# EAGLE design disp (EAGLE 7.7.0)
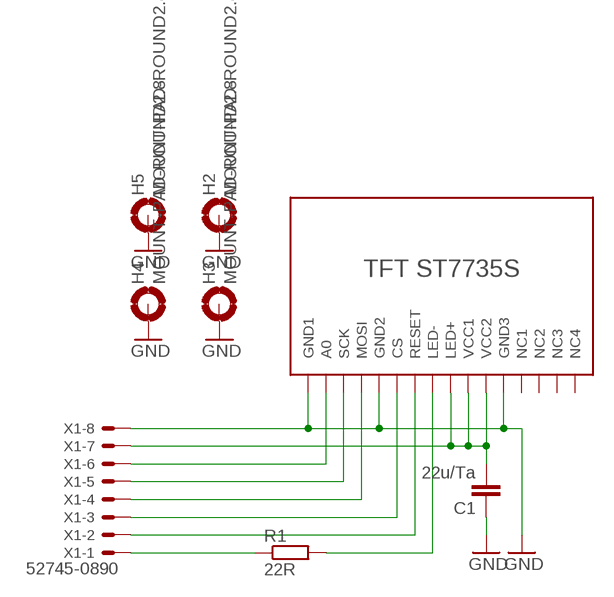
[diagram p0: schematic, sheet 1]

## Parts
C1  22u/Ta  C-EUC1206  [C1206]
H2  MOUNT-PAD-ROUND2.8  [2,8-PAD]
H3  MOUNT-PAD-ROUND2.8  [2,8-PAD]
H4  MOUNT-PAD-ROUND2.8  [2,8-PAD]
H5  MOUNT-PAD-ROUND2.8  [2,8-PAD]
R1  22R  R-EU_R0805  [R0805]
U$1  TFT_ST7735S  [TFT_ST7735S]
X1  52745-0890  [52745-0890]

## Nets
GND: C1.1 H2.B2,8(MOUNT) H3.B2,8(MOUNT) H4.B2,8(MOUNT) H5.B2,8(MOUNT) U$1.GND1 U$1.GND2 U$1.GND3 X1.8
N$2: C1.2 U$1.LED+ U$1.VCC1 U$1.VCC2 X1.7
N$4: U$1.A0 X1.6
N$5: U$1.SCK X1.5
N$6: U$1.MOSI X1.4
N$7: U$1.CS X1.3
N$8: U$1.RESET X1.2
N$9: R1.1 X1.1
N$10: R1.2 U$1.LED-
Unconnected: U$1.NC1 U$1.NC2 U$1.NC3 U$1.NC4

## Library data of the parts
C1 = rcl:C-EU: CAPACITOR, European symbol
H2-H5 = holes:MOUNT-PAD-ROUND: MOUNTING PAD, round
R1 = resistor:R-EU_: RESISTOR, European symbol
U$1 = ST7735S:TFT_ST7735S
X1 = con-molex:52745-0890: FFC/FPC-to-Board 0.50mm (.020") SMT Top Contact Right Angle, ZIF, Style Receptacle 52745 / 52435 Source: http://www.molex.com/product/ffc/52745.html; MPN: 52745-0890; OC_FARNELL: unknown; OC_NEWARK: 92M6377

## Board
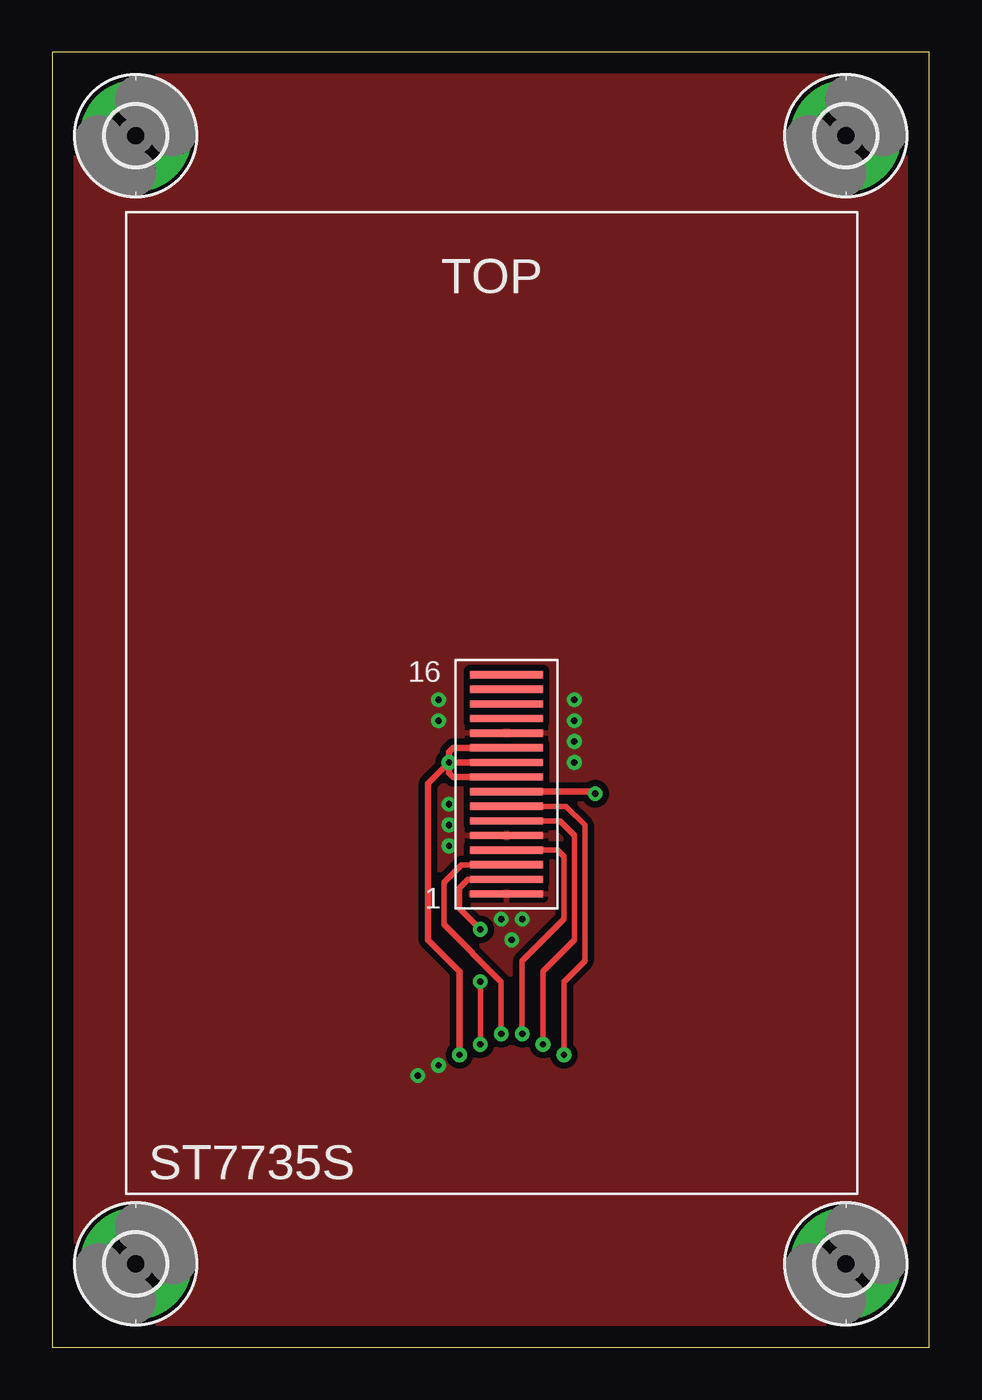
[diagram p1: board, top side]
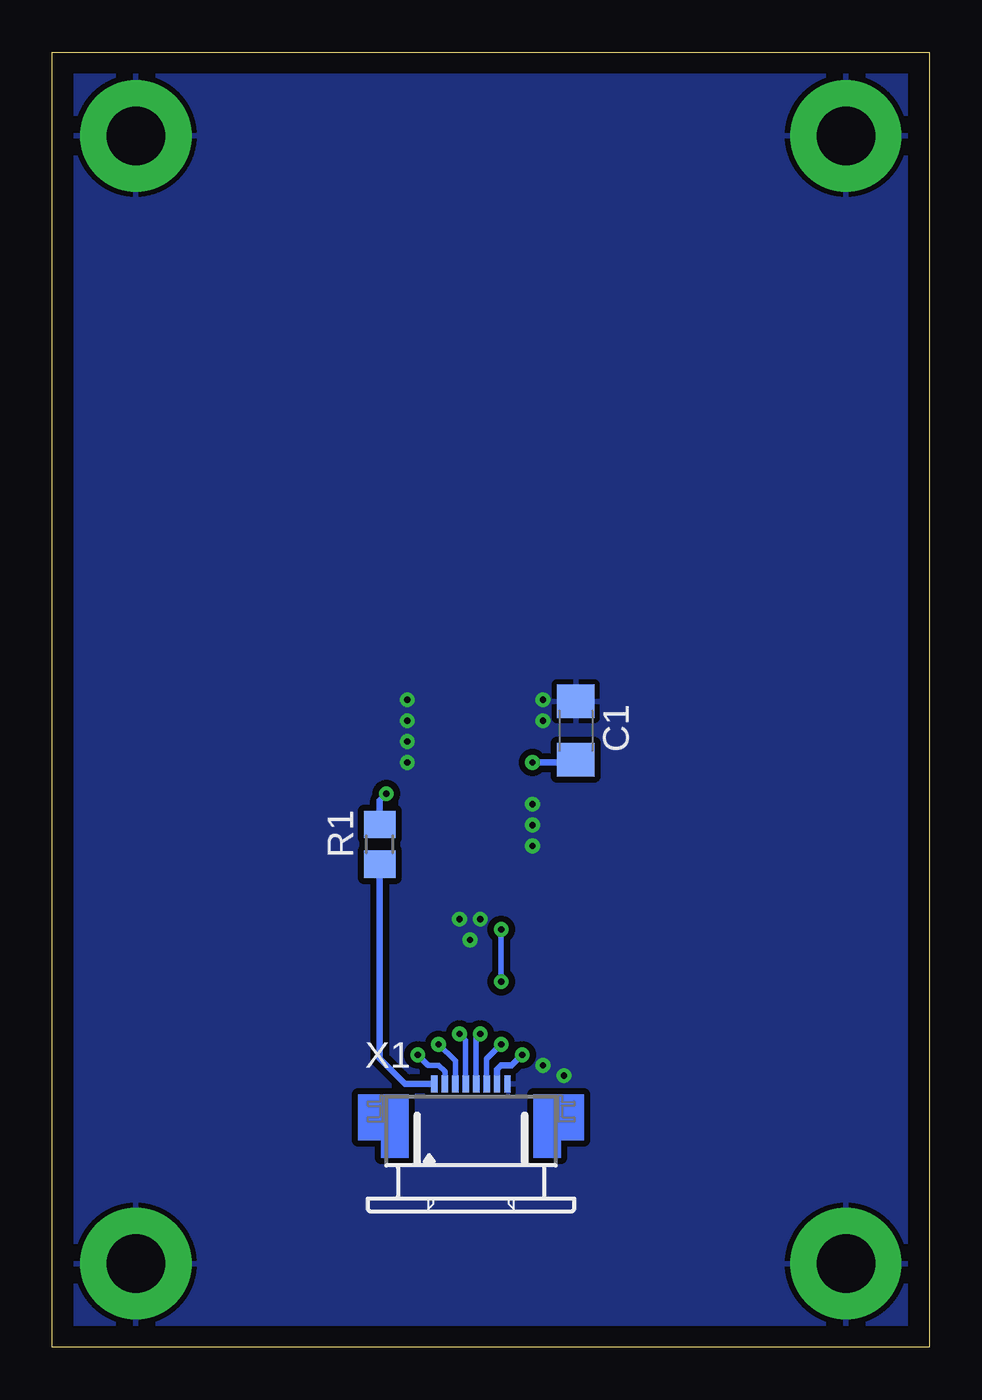
[diagram p2: board, bottom side, seen from below]

Size 42 x 62 mm. Coordinates in mm from the lower left corner, seen from the top.
Outline: 0,0 42,0 42,62 0,62 0,0
Copper layers (1*16): Top 0.035mm / dielectric 1.5mm / Bottom 0.035mm
Design rules "default *": minimum track width 10mil, minimum drill 24mil, track to track 8mil, track to pad 8mil, pad to pad 8mil, via to via 8mil, smd to smd 8mil, copper to edge 40mil, drill to drill 8mil, minimum pad ring 10mil, minimum via ring 8mil, stop-mask expansion 4mil, vias tented up to drill 0.3mm, thermal gap 10mil

### Footprints (pad centres in the part's own frame; a part is rotated, then mirrored left to right if it is on the bottom)
C1206 = smd 1.6 x 1.8: 1 -1.4,0; 2 1.4,0
2,8-PAD = drill 2.8 pad 5.334: B2,8 0,0
R0805 = smd 1.3 x 1.5: 1 -0.95,0; 2 0.95,0
TFT_ST7735S = smd 3.5 x 0.35: A0 18.2,15.05; CS 18.2,17.85; GND1 18.2,14.35; GND2 18.2,17.15; GND3 18.2,22.05; LED+ 18.2,19.95; LED- 18.2,19.25; MOSI 18.2,16.45; NC1 18.2,22.75; NC2 18.2,23.45; NC3 18.2,24.15; NC4 18.2,24.85; RESET 18.2,18.55; SCK 18.2,15.75; VCC1 18.2,20.65; VCC2 18.2,21.35
52745-0890 = smd 0.3 x 0.8: 1 -1.75,2.5; 2 -1.25,2.5; 3 -0.75,2.5; 4 -0.25,2.5; 5 0.25,2.5; 6 0.75,2.5; 7 1.25,2.5; 8 1.75,2.5

### Placement (x,y rotation side)
C1  16.93,29.52 270 bottom
H2  4,4 0 top
H3  38,4 0 top
H4  38,58 0 top
H5  4,58 0 top
R1  26.32,24.08 90 bottom
U$1  3.55,7.35 0 top
X1  21.95,10.11 0 bottom

### Tracks (layer width: path | path; a pad name or v marks a point on that pad's centre or on a via)
GND  (via drill 0.3)
  other vias: 21.5,20.5 22.5,20.5 22,19.5 19,26 19,25 19,24 18.5,30 18.5,31 25,31 25,30 25,29 25,28 18.5,13.5 17.5,13
  pour Top (isolate 0.3): 0,0 42,0 42,62 0,62
  pour Bottom (isolate 0.3): 0,0 42,0 42,62 0,62
N$2  (via drill 0.3)
  Top 0.305: U$1.VCC2 19.2,28.7 19,28.5 v19,28 | U$1.VCC1 v19,28 | U$1.LED+ 19.2,27.3 19,27.5 v19,28 | v19.5,14 19.5,18 18,19.5 18,27 v19,28
  Bottom 0.254: 17.05,28 C1.2
  Bottom 0.305: v19,28 17.05,28 | X1.7 20.7,13.3 20.5,13.5 20,13.5 v19.5,14
N$4  (via drill 0.3)
  Top 0.254: v20.5,14.5 v20.5,17.5 | U$1.A0 19.9,22.4 19.5,22 19.5,21 v20.5,20
  Bottom 0.254: X1.6 21.2,13.8 v20.5,14.5 | v20.5,20 v20.5,17.5
N$5  (via drill 0.3)
  Top 0.254: v21.5,15 21.5,17.5 18.75,20.25 18.75,22.25 19.6,23.1 U$1.SCK
  Bottom 0.254: X1.5 21.7,14.8 v21.5,15
N$6  (via drill 0.3)
  Top 0.254: v22.5,15 22.5,18.5 24.5,20.5 24.5,23.5 24.2,23.8 U$1.MOSI
  Bottom 0.254: X1.4 22.2,14.7 v22.5,15
N$7  (via drill 0.3)
  Top 0.254: U$1.CS 24.3,25.2 25,24.5 25,19.5 23.5,18 v23.5,14.5
  Bottom 0.254: X1.3 22.7,13.7 v23.5,14.5
N$8  (via drill 0.3)
  Top 0.254: U$1.RESET 24.6,25.9 25.5,25 25.5,18.5 24.5,17.5 v24.5,14
  Bottom 0.254: X1.2 23.2,13.2 23.5,13.5 24,13.5 v24.5,14
N$9
  Bottom 0.305: R1.1 26.32,13.82 25.11,12.61 X1.1
N$10  (via drill 0.3)
  Top 0.254: 25.9,26.6 v26,26.5
  Top 0.305: U$1.LED- 25.9,26.6
  Bottom 0.305: R1.2 26.32,26.18 v26,26.5

### Text on the board
tDocu: TR-9_DISP_1.0